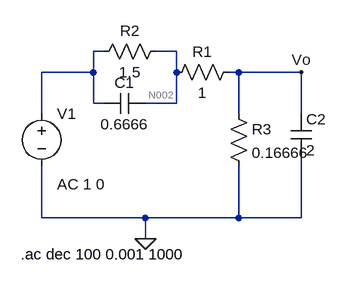
[diagram p0: schematic EJ2_2.asc]
EJ2_2.asc, the LTspice schematic file:
Version 4
SHEET 1 880 680
WIRE 32 0 16 0
WIRE 144 0 112 0
WIRE 16 32 16 0
WIRE 16 32 -64 32
WIRE 144 32 144 0
WIRE 240 32 224 32
WIRE 336 32 240 32
WIRE 16 80 16 32
WIRE 32 80 16 80
WIRE 144 80 144 32
WIRE 144 80 96 80
WIRE -64 96 -64 32
WIRE 240 96 240 32
WIRE 336 96 336 32
WIRE -64 256 -64 176
WIRE 96 256 -64 256
WIRE 240 256 240 176
WIRE 240 256 96 256
WIRE 336 256 336 160
WIRE 336 256 240 256
WIRE 96 288 96 256
FLAG 96 288 0
FLAG 336 32 Vo
SYMBOL voltage -64 80 R0
WINDOW 123 24 124 Left 2
WINDOW 39 0 0 Left 0
SYMATTR Value2 AC 1 0
SYMATTR InstName V1
SYMATTR Value ""
SYMBOL res 128 -16 R90
WINDOW 0 0 56 VBottom 2
WINDOW 3 32 56 VTop 2
SYMATTR InstName R2
SYMATTR Value 1.5
SYMBOL cap 96 64 R90
WINDOW 0 0 32 VBottom 2
WINDOW 3 32 32 VTop 2
SYMATTR InstName C1
SYMATTR Value 0.6666
SYMBOL res 224 80 R0
SYMATTR InstName R3
SYMATTR Value 0.16666
SYMBOL cap 320 96 R0
SYMATTR InstName C2
SYMATTR Value 2
SYMBOL res 240 16 R90
WINDOW 0 0 56 VBottom 2
WINDOW 3 32 56 VTop 2
SYMATTR InstName R1
SYMATTR Value 1
TEXT -96 312 Left 2 !.ac dec 100 0.001 1000

The netlist it stands for:
* EJ2_2.asc
V1 N001 0 AC 1 0
R2 N002 N001 1.5
C1 N002 N001 0.6666
R3 Vo 0 0.16666
C2 Vo 0 2
R1 Vo N002 1
.ac dec 100 0.001 1000
.backanno
.end

* Results of the author's LTspice run, read from the files saved beside the schematic
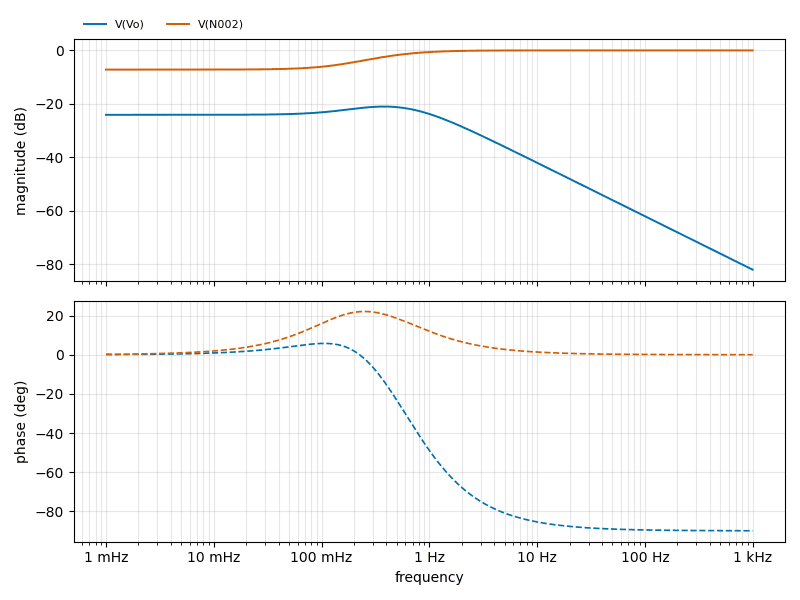
[diagram p1: AC Analysis of EJ2_2.asc, plotted from the saved traces]
* AC Analysis, 1 run:
*   V(Vo): -24.08 dB at 1 mHz, -81.98 dB at 1 kHz, peak -20.99 dB at 380.2 mHz, 3 dB below the peak at 26.25 mHz and 1.041 Hz
*   V(N002): -7.18 dB at 1 mHz, -0.00 dB at 1 kHz, peak -0.00 dB at 1 kHz, 3 dB below the peak at 311.3 mHz